# EAGLE design front (EAGLE 6.1)
DOC: PVR-SCH-001; PART_NO: PC-01; PROJECT: PVR; REV: B; TITLE: Front panel interface
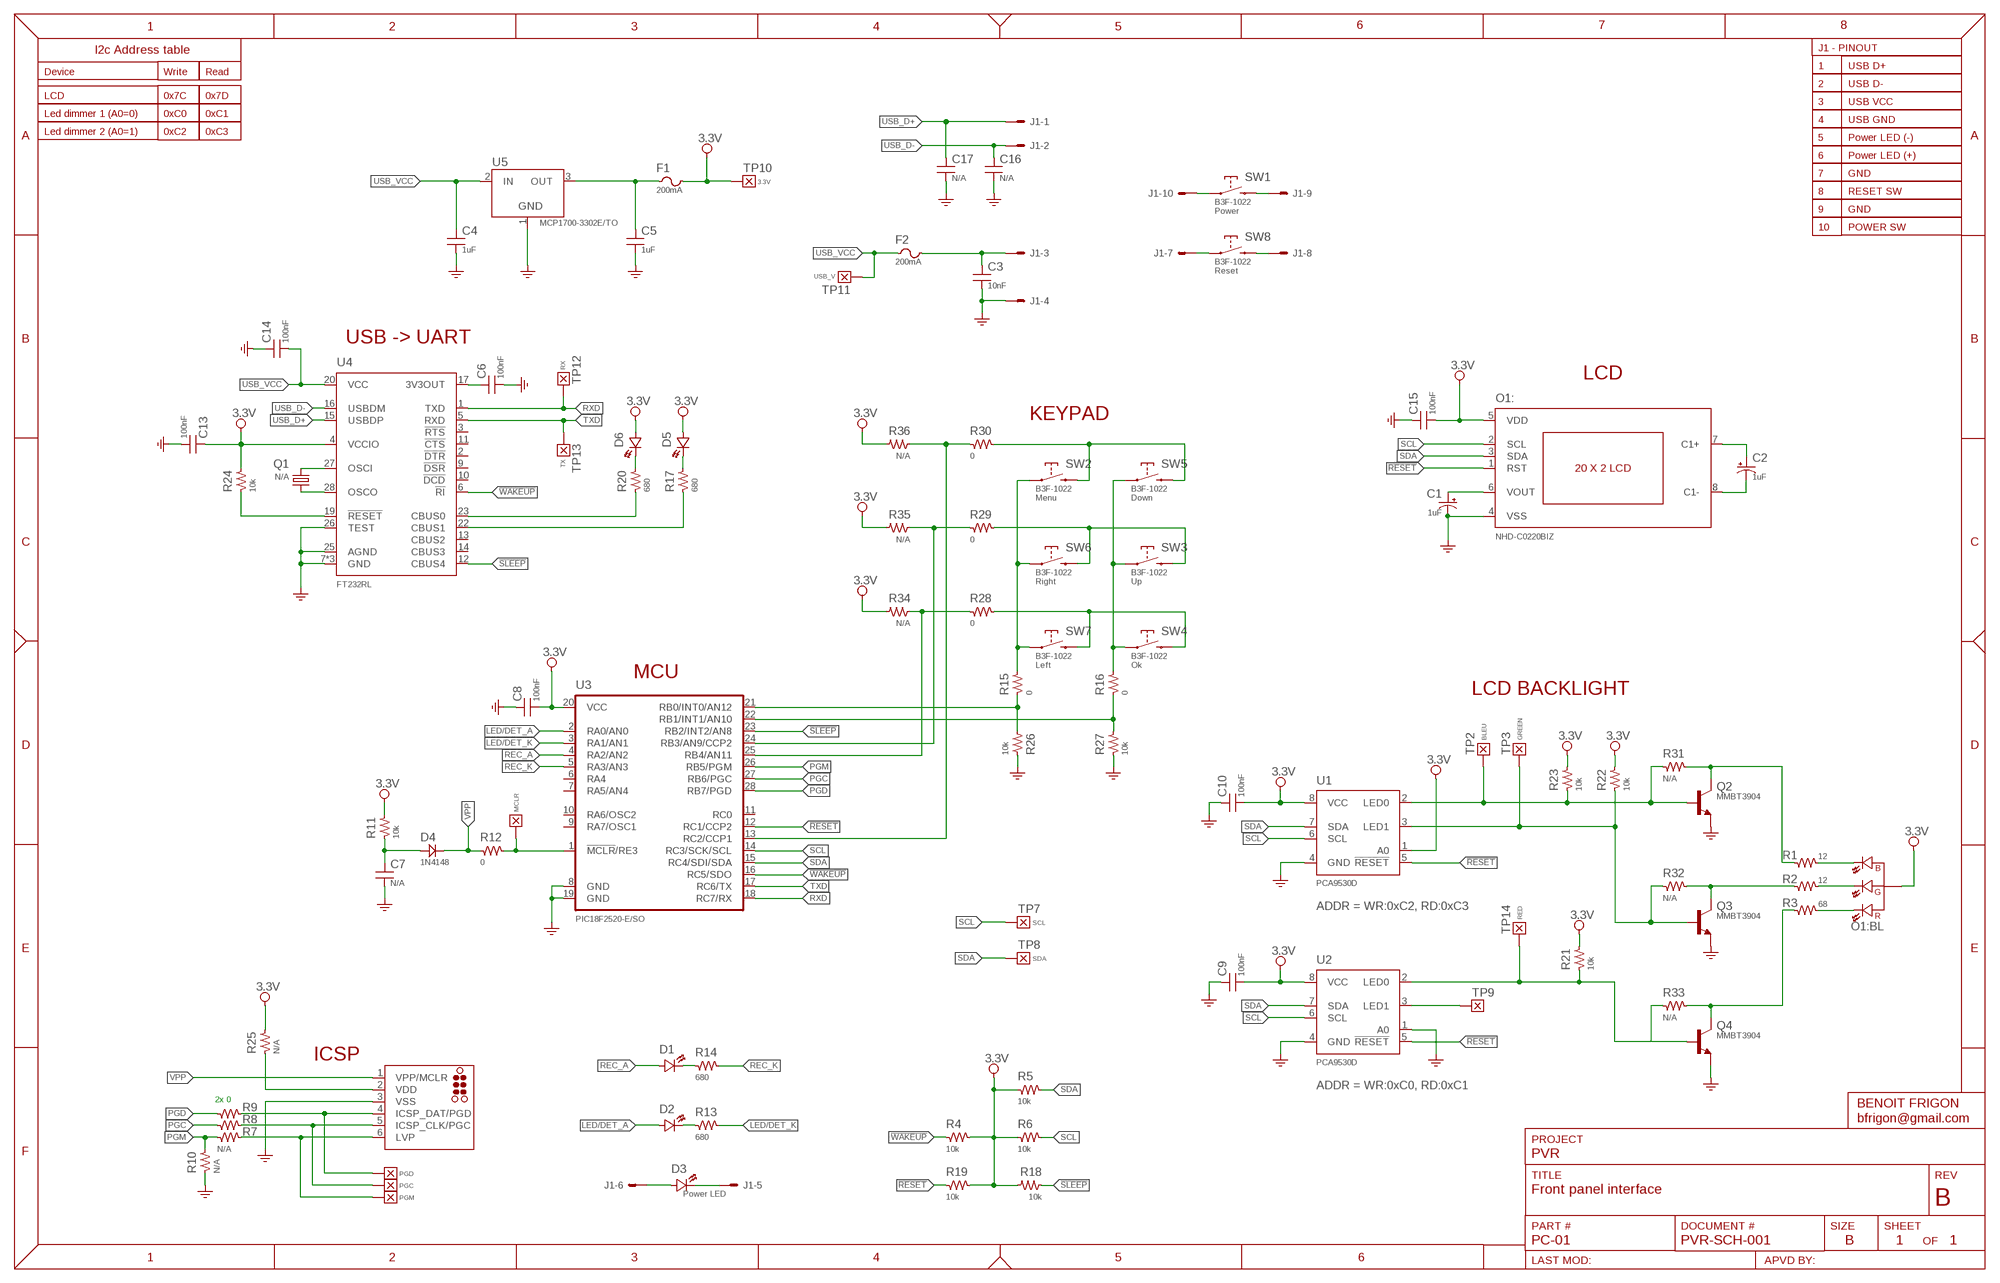
[diagram p0: schematic, sheet 1]

## Parts
C1  1uF  CAP-E-S0805  [CAP_S0805]
C2  1uF  CAP-E-S0805  [CAP_S0805]
C3  10nF  CAP-0805  [SMD_0805]
C4  1uF  CAP-0805  [SMD_0805]
C5  1uF  CAP-0805  [SMD_0805]
C6  100nF  CAP-0603  [SMD_0603]
C7  N/A  CAP-0603  [SMD_0603]
C8  100nF  CAP-0603  [SMD_0603]
C9  100nF  CAP-0603  [SMD_0603]
C10  100nF  CAP-0603  [SMD_0603]
C13  100nF  CAP-0603  [SMD_0603]
C14  100nF  CAP-0603  [SMD_0603]
C15  100nF  CAP-0603  [SMD_0603]
C16  N/A  CAP-0603  [SMD_0603]
C17  N/A  CAP-0603  [SMD_0603]
D1  {ATTR:COLOR}  LED-2X5  [LED_2X5]
D2  {ATTR:COLOR}  LED-2X5  [LED_2X5]
D3  {ATTR:COLOR}  LED-2X5  [LED_2X5]
D4  1N4148  DIODE-0603  [DIODE_0603]
D5  LED-0805  [CHIPLED_0805]
D6  LED-0805  [CHIPLED_0805]
F1  200mA  FUSE1206  [SMD_1206]
F2  200mA  FUSE1206  [SMD_1206]
J1  DL-100-HEADER-10-V  [534206-5]
J10  TC2030-MCP  [TC2030-MCP]
O1  NHD-C0220BIZ  [NHD-CO220BIZ]
Q1  N/A  XTALMM20SS  [MM20SS]
Q2  MMBT3904  [SOT23]
Q3  MMBT3904  [SOT23]
Q4  MMBT3904  [SOT23]
R1  12  RES-1206  [SMD_1206]
R2  12  RES-1206  [SMD_1206]
R3  68  RES-1206  [SMD_1206]
R4  10k  RES-0805  [SMD_0805]
R5  10k  RES-0805  [SMD_0805]
R6  10k  RES-0805  [SMD_0805]
R7  N/A  RES-0603  [SMD_0603]
R8  0  RES-0603  [SMD_0603]
R9  0  RES-0603  [SMD_0603]
R10  N/A  RES-0603  [SMD_0603]
R11  10k  RES-0603  [SMD_0603]
R12  0  RES-0603  [SMD_0603]
R13  680  RES-0805  [SMD_0805]
R14  680  RES-0805  [SMD_0805]
R15  0  RES-0805  [SMD_0805]
R16  0  RES-0805  [SMD_0805]
R17  680  RES-0805  [SMD_0805]
R18  10k  RES-0805  [SMD_0805]
R19  10k  RES-0805  [SMD_0805]
R20  680  RES-0805  [SMD_0805]
R21  10k  RES-0805  [SMD_0805]
R22  10k  RES-0805  [SMD_0805]
R23  10k  RES-0805  [SMD_0805]
R24  10k  RES-0603  [SMD_0603]
R25  N/A  RES-0603  [SMD_0603]
R26  10k  RES-0603  [SMD_0603]
R27  10k  RES-0603  [SMD_0603]
R28  0  RES-0603  [SMD_0603]
R29  0  RES-0805  [SMD_0805]
R30  0  RES-0805  [SMD_0805]
R31  N/A  RES-1206  [SMD_1206]
R32  N/A  RES-1206  [SMD_1206]
R33  N/A  RES-1206  [SMD_1206]
R34  N/A  RES-0603  [SMD_0603]
R35  N/A  RES-0603  [SMD_0603]
R36  N/A  RES-0603  [SMD_0603]
SW1  B3F-1022  [B3F-10XX]
SW2  B3F-1022  [B3F-10XX]
SW3  B3F-1022  [B3F-10XX]
SW4  B3F-1022  [B3F-10XX]
SW5  B3F-1022  [B3F-10XX]
SW6  B3F-1022  [B3F-10XX]
SW7  B3F-1022  [B3F-10XX]
SW8  B3F-1022  [B3F-10XX]
TP1  MCLR  TEST_POINT-050  [TP_050]
TP2  BLEU  TEST_POINT-050  [TP_050]
TP3  GREEN  TEST_POINT-050  [TP_050]
TP4  PGD  TEST_POINT-050  [TP_050]
TP5  PGC  TEST_POINT-050  [TP_050]
TP6  PGM  TEST_POINT-050  [TP_050]
TP7  SCL  TEST_POINT-050  [TP_050]
TP8  SDA  TEST_POINT-050  [TP_050]
TP9  TEST_POINT-050  [TP_050]
TP10  3.3V  TEST_POINT-050  [TP_050]
TP11  USB_V  TEST_POINT-050  [TP_050]
TP12  RX  TEST_POINT-050  [TP_050]
TP13  TX  TEST_POINT-050  [TP_050]
TP14  RED  TEST_POINT-050  [TP_050]
U1  PCA9530D  [SOIC8]
U2  PCA9530D  [SOIC8]
U3  PIC18F2520-E/SO  [SOIC28]
U4  FT232RL  [SSOP28]
U5  MCP1700-3302E/TO  [TO92]

## Nets
3.3V: C8.2 C9.2 C10.2 C13.1 C15.2 D5.A D6.A F1.2 O1.5(::VDD) O1.A(:BL:A) R4.2 R5.1 R6.1 R11.2 R18.2 R19.2 R21.2 R22.2 R23.2 R24.2 R25.2 R34.2 R35.2 R36.2 TP10.1 U1.1(A0) U1.8(VCC) U2.8(VCC) U3.20(VCC) U4.4(VCCIO)
!RESET: O1.1(::RST) R19.1 U1.5(!RESET) U2.5(!RESET) U3.12(RC1/CCP2)
!SLEEP: R18.1 U3.23(RB2/INT2/AN8) U4.12(CBUS4)
!WAKEUP: R4.1 U3.16(RC5/SDO) U4.6(!RI)
GND: C1.- C3.2 C4.2 C5.2 C6.2 C7.2 C8.1 C9.1 C10.1 C13.2 C14.1 C15.1 C16.2 C17.2 J1.4 J10.3(VSS) O1.4(::VSS) Q2.2(E) Q3.2(E) Q4.2(E) R10.1 R26.1 R27.1 U1.4(GND) U2.1(A0) U2.4(GND) U3.8(GND) U3.19(GND) U4.7(GND) U4.18(GND) U4.21(GND) U4.25(AGND) U4.26(TEST) U5.1(GND)
LED/DET_A: D2.A U3.2(RA0/AN0)
LED/DET_K: R13.2 U3.3(RA1/AN1)
N$4: O1.BK(:BL:BK) R1.2
N$5: O1.GK(:BL:GK) R2.2
N$6: O1.RK(:BL:RK) R3.2
N$7: Q2.1(B) R23.1 R31.1 TP2.1 U1.2(LED0)
N$8: Q3.1(B) R22.1 R32.1 TP3.1 U1.3(LED1)
N$9: Q2.3(C) R1.1 R31.2
N$10: J1.10 SW1.3 SW1.4
N$11: J1.9 SW1.1 SW1.2
N$12: J1.8 SW8.1 SW8.2
N$13: J1.7 SW8.3 SW8.4
N$14: D3.A J1.6
N$15: D3.K J1.5
N$17: C6.1 U4.17(3V3OUT)
N$18: J10.6(LVP) R7.2 TP6.1
N$19: J10.5(ICSP_CLK/PGC) R8.2 TP5.1
N$20: J10.4(ICSP_DAT/PGD) R9.2 TP4.1
N$21: R15.1 R26.2 U3.21(RB0/INT0/AN12)
N$22: R16.1 R27.2 U3.22(RB1/INT1/AN10)
N$23: R30.1 R36.1 U3.13(RC2/CCP1)
N$24: R29.1 R35.1 U3.24(RB3/AN9/CCP2)
N$25: R28.1 R34.1 U3.25(RB4/AN11)
N$26: R12.2 TP1.1 U3.1(!MCLR!/RE3)
N$27: D2.K R13.1
N$28: R15.2 SW2.3 SW2.4 SW6.3 SW6.4 SW7.3 SW7.4
N$29: D1.K R14.1
N$30: R16.2 SW3.3 SW3.4 SW4.3 SW4.4 SW5.3 SW5.4
N$31: R17.1 U4.22(CBUS1)
N$32: R20.1 U4.23(CBUS0)
N$33: D6.K R20.2
N$34: D5.K R17.2
N$35: Q3.3(C) R2.1 R32.2
N$36: Q4.3(C) R3.1 R33.2
N$37: C5.1 F1.1 U5.3(OUT)
N$38: Q4.1(B) R21.1 R33.1 TP14.1 U2.2(LED0)
N$39: C3.1 F2.2 J1.3
N$40: Q1.1 U4.27(OSCI)
N$41: Q1.4 U4.28(OSCO)
N$42: C2.+ O1.7(::C1+)
N$43: C2.- O1.8(::C1-)
N$44: C1.+ O1.6(::VOUT)
N$45: TP9.1 U2.3(LED1)
N$46: R24.1 U4.19(!RESET)
N$47: J10.2(VDD) R25.1
N$48: C7.1 D4.A R11.1
N$49: R30.2 SW2.1 SW2.2 SW5.1 SW5.2
N$50: R29.2 SW3.1 SW3.2 SW6.1 SW6.2
N$51: R28.2 SW4.1 SW4.2 SW7.1 SW7.2
PGC: R8.1 U3.27(RB6/PGC)
PGD: R9.1 U3.28(RB7/PGD)
PGM: R7.1 R10.2 U3.26(RB5/PGM)
REC_A: D1.A U3.4(RA2/AN2)
REC_K: R14.2 U3.5(RA3/AN3)
RXD: TP12.1 U3.18(RC7/RX) U4.1(TXD)
SCL: O1.2(::SCL) R6.2 TP7.1 U1.6(SCL) U2.6(SCL) U3.14(RC3/SCK/SCL)
SDA: O1.3(::SDA) R5.2 TP8.1 U1.7(SDA) U2.7(SDA) U3.15(RC4/SDI/SDA)
TXD: TP13.1 U3.17(RC6/TX) U4.5(RXD)
USB_D+: C17.1 J1.1 U4.15(USBDP)
USB_D-: C16.1 J1.2 U4.16(USBDM)
USB_VCC: C4.1 C14.2 F2.1 TP11.1 U4.20(VCC) U5.2(IN)
VPP: D4.K J10.1(VPP/MCLR) R12.1
Unconnected: U3.6(RA4) U3.7(RA5/AN4) U3.9(RA7/OSC1) U3.10(RA6/OSC2) U3.11(RC0) U4.2(!DTR) U4.3(!RTS) U4.9(!DSR) U4.10(!DCD) U4.11(!CTS) U4.13(CBUS2) U4.14(CBUS3)

## Notes on the sheet
- I2c Address table
- USB -> UART
- LCD
- KEYPAD
- MCU
- LCD BACKLIGHT
- ICSP
- 2x 0

## Library data of the parts
C1 C2 = Passive:CAP-E: Electrolytic capacitor; DESCRIPTION: {DESCRIPTION} - SMT 0805 - {VALUE}
C3-C5 = Passive:CAP: Capacitor; DESCRIPTION: {DESCRIPTION} - SMT 0805 - {value}; PACKAGE: SMT 0805
C6-C10 C13-C17 = Passive:CAP: Capacitor; DESCRIPTION: {DESCRIPTION} - SMT 0603 - {value}; PACKAGE: SMT 0603
D1 = Optoelectronic:LED: Led; COLOR: Red; DESCRIPTION: {DESCRIPTION} 2x5mm - {ATTR:COLOR}; PACKAGE: 2x5mm; SKU: -
D2 = Optoelectronic:LED: Led; COLOR: Green; DESCRIPTION: {DESCRIPTION} 2x5mm - {ATTR:COLOR}; PACKAGE: 2x5mm; SKU: -
D3 = Optoelectronic:LED: Led; COLOR: Green; DESCRIPTION: {DESCRIPTION} 2x5mm - {ATTR:COLOR}; ID: Power LED; PACKAGE: 2x5mm; SKU: -
D4 = Passive:DIODE: Diode; DESCRIPTION: {DESCRIPTION} - SMT 0603 - {VALUE}; PACKAGE: SMT 0603; SKU: {VALUE}
D5 D6 = Optoelectronic:LED: Led; COLOR: Green; DESCRIPTION: {DESCRIPTION} Chip 0805 - {ATTR:COLOR}; PACKAGE: SMT 0805; SKU: -; VALUE: {ATTR:COLOR}
F1 F2 = Passive:FUSE: Fuse; DESCRIPTION: {DESCRIPTION} - SMT 1206 - {VALUE}
J1 = Connectors:DL-100-HEADER-10: 10 Pos - Dual Row - 2.54mm; DESCRIPTION: {DESCRIPTION} Receptacle - Vertical; MFG: Sullins Connector Solutions; SKU: SIP110-PPPC-D05-ST-BK
J10 = Connectors:TC2030: TAG-CONNECT ISP Connector Manufacturer: Tag-Connect <www.tag-connect.com> Cable for easy In-Circuit PCB Programming. Designed for Microchip ICD2, suitable for many others. Two variants - one "with legs" (for hads-free fit on PCB) and another "without legs" for quick programming. PAD Description 1 MCLR/Vpp 2 Vdd 3 GND 4 PGD (ISPDAT) 5 PGC (ISPCLK) 6 nc (used for LVP) ©2009 ROFA.cz; MFG: Tag-Connect; NO_BOM: 1
O1 = Optoelectronic:NHD-C0220BIZ: Alphanumeric LCD module 20x2 - RGB Backlight; MFG: Newheaven Display
Q1 = Crystal:XTAL: Crystal
Q2-Q4 = Transistor:MMBT3904: NPN Transistor
R1-R3 R31-R33 = Passive:RES: Resistor; DESCRIPTION: {DESCRIPTION} - SMT 1206 - {VALUE}; PACKAGE: SMT 1206
R4-R6 R13-R23 R29 R30 = Passive:RES: Resistor; DESCRIPTION: {DESCRIPTION} - SMT 0805 - {VALUE}; PACKAGE: SMT 0805
R7-R12 R24-R28 R34-R36 = Passive:RES: Resistor; DESCRIPTION: {DESCRIPTION} - SMT 0603 - {VALUE}; PACKAGE: SMT 0603
SW1 = Switch:B3F-?: Tactile switch; DESCRIPTION: {DESCRIPTION} - 6x6mm - 5mm Pitch - 150g; KEY: Power; MFG: Omron Electronics
SW2 = Switch:B3F-?: Tactile switch; DESCRIPTION: {DESCRIPTION} - 6x6mm - 5mm Pitch - 150g; KEY: Menu; MFG: Omron Electronics
SW3 = Switch:B3F-?: Tactile switch; DESCRIPTION: {DESCRIPTION} - 6x6mm - 5mm Pitch - 150g; KEY: Up; MFG: Omron Electronics
SW4 = Switch:B3F-?: Tactile switch; DESCRIPTION: {DESCRIPTION} - 6x6mm - 5mm Pitch - 150g; KEY: Ok; MFG: Omron Electronics
SW5 = Switch:B3F-?: Tactile switch; DESCRIPTION: {DESCRIPTION} - 6x6mm - 5mm Pitch - 150g; KEY: Down; MFG: Omron Electronics
SW6 = Switch:B3F-?: Tactile switch; DESCRIPTION: {DESCRIPTION} - 6x6mm - 5mm Pitch - 150g; KEY: Right; MFG: Omron Electronics
SW7 = Switch:B3F-?: Tactile switch; DESCRIPTION: {DESCRIPTION} - 6x6mm - 5mm Pitch - 150g; KEY: Left; MFG: Omron Electronics
SW8 = Switch:B3F-?: Tactile switch; DESCRIPTION: {DESCRIPTION} - 6x6mm - 5mm Pitch - 150g; KEY: Reset; MFG: Omron Electronics
TP1-TP14 = Misc:TEST_POINT; NO_BOM: 1
U1 = IC:PCA9530: 8-bit I2C-bus LED dimmer Features: 2 LED drivers (on, off, flashing at a programmable rate) 2 selectable, fully programmable blink rates (frequency and duty cycle) between 0.591 Hz and 152 Hz (1.69 seconds and 6.58 milliseconds) 256 brightness steps Input/output not used as LED drivers can be used as regular GPIOs Internal oscillator requires no external components I2C-bus interface logic compatible with SMBus Internal power-on reset; ADDR: WR:0xC2, RD:0xC3; MFG: NXP Semiconductors
U2 = IC:PCA9530: 8-bit I2C-bus LED dimmer Features: 2 LED drivers (on, off, flashing at a programmable rate) 2 selectable, fully programmable blink rates (frequency and duty cycle) between 0.591 Hz and 152 Hz (1.69 seconds and 6.58 milliseconds) 256 brightness steps Input/output not used as LED drivers can be used as regular GPIOs Internal oscillator requires no external components I2C-bus interface logic compatible with SMBus Internal power-on reset; ADDR: WR:0xC0, RD:0xC1; MFG: NXP Semiconductors
U3 = IC:PIC18F*520-?: Microcontroller 32k PROG / 1536 RAM / 256 EEPROM
U4 = IC:FT232: USB to serial UART interface
U5 = Power:MCP1700-*?: Low-dropout (LDO) Voltage Regulator; DESCRIPTION: {DESCRIPTION} - 3.3v; MFG: Microchip

## Board
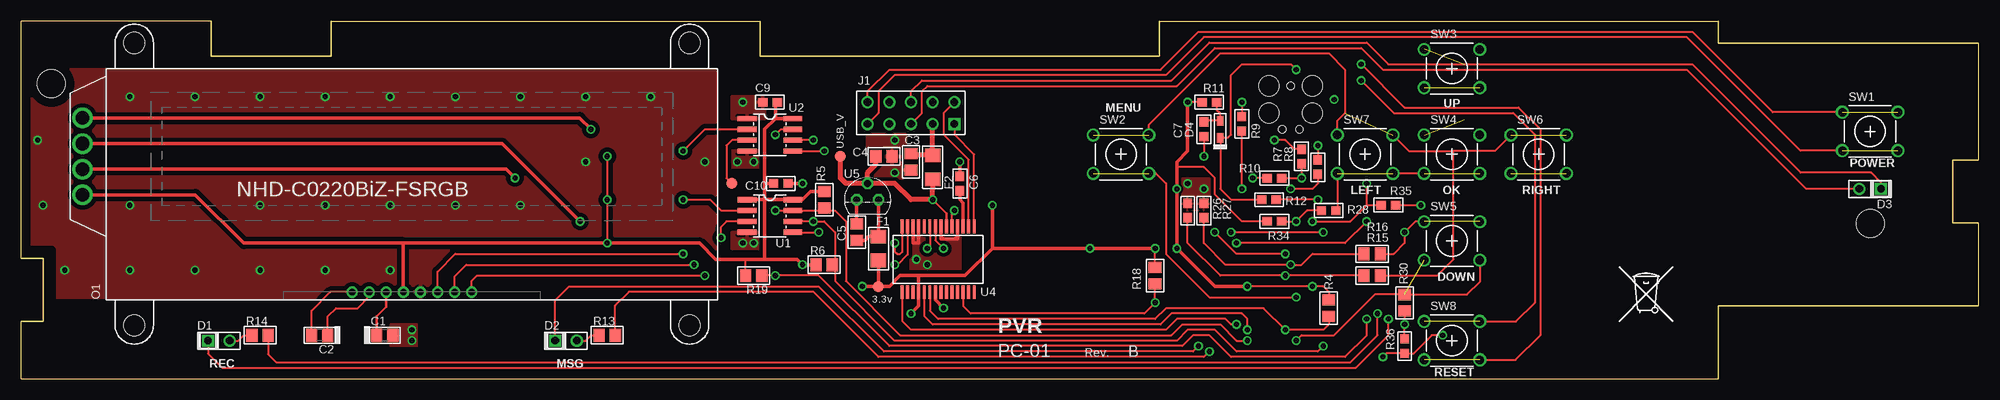
[diagram p1: board, top side]
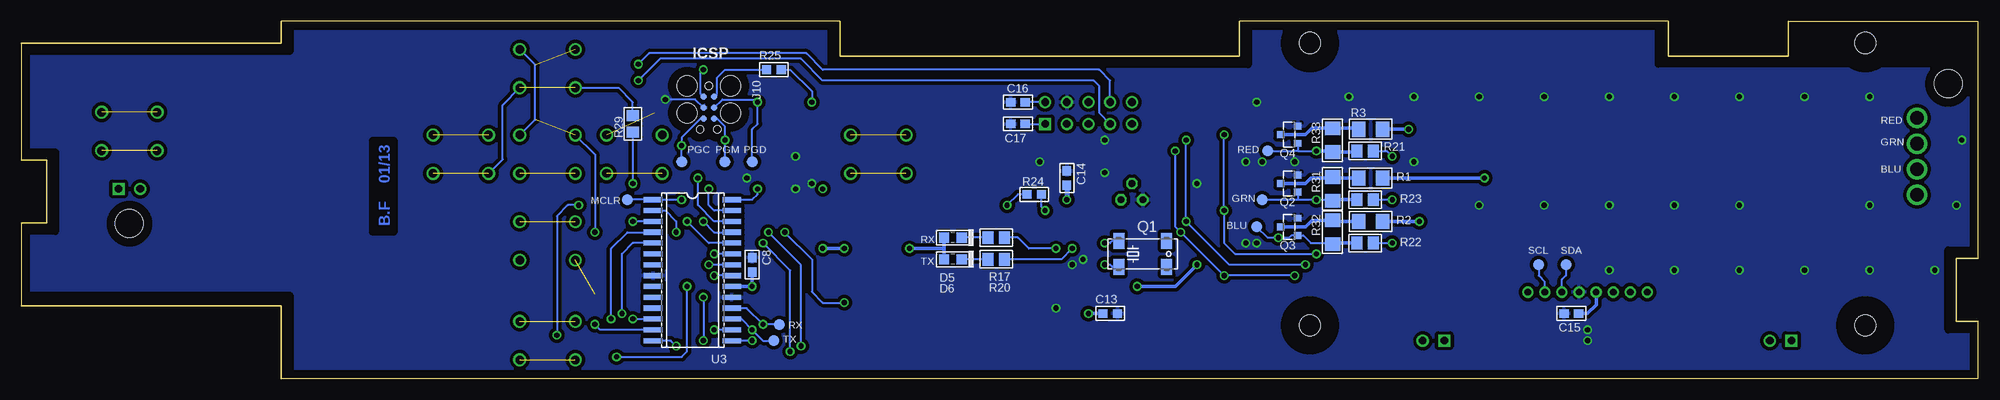
[diagram p2: board, bottom side, seen from below]

Size 229.06 x 41.86 mm. Coordinates in mm from the lower left corner, seen from the top.
Outline: 0,0 198.63,0 198.63,8.51 229.06,8.51 229.06,18.24 226.06,18.24 226.06,25.58 229.06,25.58 229.06,39.32 198.63,39.32 198.63,41.86 133.25,41.86 133.25,37.8 86.46,37.8 86.46,41.86 36.27,41.86 36.27,37.8 22.23,37.8 22.23,41.86 0,41.86 0,14.07 2.54,14.07 2.54,6.71 0,6.71 0,0
Copper layers (1*16): Top 0.035mm / dielectric 1.5mm / Bottom 0.035mm
Design rules: minimum track width 10mil, minimum drill 24mil, track to track 8mil, track to pad 8mil, pad to pad 8mil, via to via 8mil, smd to smd 8mil, copper to edge 40mil, drill to drill 8mil, minimum pad ring 10mil, minimum via ring 8mil, stop-mask expansion 4mil, vias tented up to drill 24mil, thermal gap 10mil
Holes 3.3 mm at 3.51,34.54 216.41,18.16
tKeepout: area 178.6,31.1 to 182.1,34.6; area 178.6,17.9 to 182.1,21.5; area 191.4,16.8 to 195,20.3; area 219.3,16.8 to 222.9,20.3; area 150.6,17.9 to 154.2,21.5; area 141.2,24.3 to 144.8,27.8; area 134.6,5.1 to 151.1,7.6; area 134.6,35.6 to 151.1,38.1
tRestrict: area 0,5.7 to 3.6,15.1
bRestrict: area 185.4,17.1 to 188,27.9; area 0,36.8 to 37.5,41.9; area 85.4,36.8 to 134.3,41.9; area 0,5.7 to 3.6,15.1; area 197.6,0 to 229.1,9.8; area 225,17.2 to 229.1,26.6; area 197.6,38.3 to 229.1,41.9
Milling: 16 lines

### Footprints (pad centres in the part's own frame; a part is rotated, then mirrored left to right if it is on the bottom)
CAP_S0805 = smd 1.3 x 1.5: + -0.95,0; - 0.95,0
SMD_0805 = smd 1.3 x 1.5: 1 -0.95,0; 2 0.95,0
SMD_0603 = smd 1.1 x 1: 1 -0.85,0; 2 0.85,0
LED_2X5 = drill 0.9 square: A -1.27,0 | drill 0.9: K 1.27,0
DIODE_0603 = smd 1.1 x 0.8: A -1,0; K 1,0
CHIPLED_0805 = smd 1.2 x 1.2: A 0,-1.05; K 0,1.05
SMD_1206 = smd 1.6 x 1.8: 1 -1.4,0; 2 1.4,0
534206-5 = drill 0.9 square: 1 5.08,-1.27 | drill 0.9: 2 5.08,1.27; 3 2.54,-1.27; 4 2.54,1.27; 5 0,-1.27; 6 0,1.27; 7 -2.54,-1.27; 8 -2.54,1.27; 9 -5.08,-1.27; 10 -5.08,1.27
TC2030-MCP = smd 0.787 x 0.787: 1 1.27,-0.635; 2 1.27,0.635; 3 2.54,-0.635; 4 2.54,0.635; 5 3.81,-0.635; 6 3.81,0.635 | hole 0.889: 0,0; 5.08,-1.016; 5.08,1.016 | hole 2.375: 0,2.54; 0,-2.54; 3.175,-2.54; 3.175,2.54
NHD-CO220BIZ = drill 0.8: 1 7,-15.9; 2 5,-15.9; 3 3,-15.9; 4 1,-15.9; 5 -1,-15.9; 6 -3,-15.9; 7 -5,-15.9; 8 -7,-15.9 | drill 1.6: A -38.55,-4.5; BK -38.55,-1.5; GK -38.55,1.5; RK -38.55,4.5 | hole 2.5: -32.5,13.3; 32.5,13.3; 32.5,-19.8; -32.5,-19.8
MM20SS = smd 1.27 x 1.88: 1 -2.794,-1.524; 2 2.794,-1.524; 3 2.794,1.524; 4 -2.794,1.524
SOT23 = smd 0.8 x 0.9: 1 -1,-1; 2 1,-1; 3 0,1
B3F-10XX = drill 1: 1 3.25,-2.25; 2 -3.25,-2.25; 3 3.25,2.25; 4 -3.25,2.25
TP_050 = smd 1.27 x 1.27: 1 0,0
SOIC8 = smd 0.6 x 2.2: 1 -1.905,-2.667; 2 -0.635,-2.667; 3 0.635,-2.667; 4 1.905,-2.667; 5 1.905,2.667; 6 0.635,2.667; 7 -0.635,2.667; 8 -1.905,2.667
SOIC28 = smd 0.6 x 2.2: 1 -8.255,-4.6; 2 -6.985,-4.6; 3 -5.715,-4.6; 4 -4.445,-4.6; 5 -3.175,-4.6; 6 -1.905,-4.6; 7 -0.635,-4.6; 8 0.635,-4.6; 9 1.905,-4.6; 10 3.175,-4.6; 11 4.445,-4.6; 12 5.715,-4.6; 13 6.985,-4.6; 14 8.255,-4.6; 15 8.255,4.6; 16 6.985,4.6; 17 5.715,4.6; 18 4.445,4.6; 19 3.175,4.6; 20 1.905,4.6; 21 0.635,4.6; 22 -0.635,4.6; 23 -1.905,4.6; 24 -3.175,4.6; 25 -4.445,4.6; 26 -5.715,4.6; 27 -6.985,4.6; 28 -8.255,4.6
SSOP28 = smd 0.34 x 1.6: 1 -4.225,-3.85; 2 -3.575,-3.85; 3 -2.925,-3.85; 4 -2.275,-3.85; 5 -1.625,-3.85; 6 -0.975,-3.85; 7 -0.325,-3.85; 8 0.325,-3.85; 9 0.975,-3.85; 10 1.625,-3.85; 11 2.275,-3.85; 12 2.925,-3.85; 13 3.575,-3.85; 14 4.225,-3.85; 15 4.225,3.85; 16 3.575,3.85; 17 2.925,3.85; 18 2.275,3.85; 19 1.625,3.85; 20 0.975,3.85; 21 0.325,3.85; 22 -0.325,3.85; 23 -0.975,3.85; 24 -1.625,3.85; 25 -2.275,3.85; 26 -2.925,3.85; 27 -3.575,3.85; 28 -4.225,3.85
TO92 = drill 0.813 octagon: 1 -1.27,0; 2 0,1.905; 3 1.27,0

### Placement (x,y rotation side)
C1  42.55,5.08 0 top
C2  34.92,5.08 180 top
C3  104.14,25.4 270 top
C4  100.97,26.04 0 top
C5  97.79,17.14 90 top
C6  109.86,22.86 90 top
C7  138.43,29.21 270 top
C8  143.51,13.34 270 bottom
C9  87.63,32.38 0 top
C10  88.9,22.86 180 top
C13  101.6,7.62 0 bottom
C14  106.68,23.5 270 bottom
C15  47.62,7.62 0 bottom
C16  112.39,32.38 180 bottom
C17  112.39,29.84 180 bottom
D1  23.11,4.45 0 top
D2  63.75,4.45 0 top
D3  216.41,22.23 180 top
D4  140.34,29.21 270 top
D5  120.02,16.51 270 bottom
D6  120.02,13.97 270 bottom
F1  100.33,15.24 270 top
F2  106.68,24.77 90 top
J1  104.14,31.11 0 top
J10  148.59,34.29 270 bottom
O1  45.72,26.04 0 top
Q1  97.79,14.61 0 bottom
Q2  80.64,22.86 90 bottom
Q3  80.64,17.78 90 bottom
Q4  80.64,28.57 90 bottom
R1  71.12,23.5 0 bottom
R2  71.12,18.41 0 bottom
R3  71.12,29.21 0 bottom
R4  153.03,8.26 90 top
R5  93.98,20.95 270 top
R6  93.98,13.34 0 top
R7  149.86,26.04 90 top
R8  151.76,24.77 90 top
R9  142.88,29.84 90 top
R10  146.69,23.5 0 top
R11  139.06,32.38 180 top
R12  146.05,20.95 0 top
R13  68.58,5.08 0 top
R14  27.94,5.08 0 top
R15  158.12,12.06 0 top
R16  158.12,14.61 0 top
R17  114.94,16.51 180 bottom
R18  132.72,12.06 90 top
R19  85.72,12.06 180 top
R20  114.94,13.97 180 bottom
R21  71.75,26.67 0 bottom
R22  71.75,15.88 0 bottom
R23  71.75,20.95 0 bottom
R24  110.49,21.59 180 bottom
R25  140.97,36.2 0 bottom
R26  136.53,19.68 270 top
R27  138.43,19.68 270 top
R28  153.03,19.68 0 top
R29  157.48,29.84 90 bottom
R30  161.93,8.89 90 top
R31  75.56,22.23 90 bottom
R32  75.56,17.14 90 bottom
R33  75.56,27.94 90 bottom
R34  146.69,18.41 180 top
R35  160.02,20.32 0 top
R36  161.93,3.81 270 top
SW1  216.41,28.96 0 top
SW2  128.73,26.29 0 top
SW3  167.46,36.32 0 top
SW4  167.46,26.29 0 top
SW5  167.46,16.13 0 top
SW6  177.62,26.29 0 top
SW7  157.3,26.29 0 top
SW8  167.46,4.45 0 top
TP1  158.12,20.95 0 bottom
TP2  83.82,20.95 0 bottom
TP3  84.45,17.78 0 bottom
TP4  143.51,25.4 0 bottom
TP5  151.76,25.4 0 bottom
TP6  146.69,25.4 0 bottom
TP7  51.44,13.34 0 bottom
TP8  48.26,13.34 0 bottom
TP9  83.19,22.86 0 top
TP10  100.33,10.79 0 top
TP11  95.89,26.04 0 top
TP12  140.34,6.35 0 bottom
TP13  140.97,4.45 90 bottom
TP14  83.19,26.67 0 bottom
U1  87.63,19.05 270 top
U2  87.63,28.57 270 top
U3  150.5,12.7 270 bottom
U4  107.31,13.97 0 top
U5  99.06,20.95 0 top
U$1  [INFO]  125.73,5.08 0 top
U$2  [TRASH_SMALL]  190.5,10.16 0 top
U$3  [INFO_AUTHOR]  186.69,19.68 270 bottom
U$4  [INFO_DATE]  186.69,25.4 270 bottom

### Tracks (layer width: path | path; a pad name or v marks a point on that pad's centre or on a via)
3.3V  (via drill 0.61)
  Top 0.254: R19.2 84.78,13.97 | v143.51,10.79 v151.13,10.79 152.4,10.79 153.03,10.16 R4.2 | v68.58,15.88 v68.58,20.95 v68.58,26.04 | R11.2 v136.53,32.38 | R18.2 v132.72,15.24 | R34.2 142.88,18.41 139.7,21.59 139.7,23.5 138.43,24.77 135.25,24.77 | v159.38,2.54 159.81,2.96 R36.2 162.98,2.96 165.1,5.08 v166.37,5.08 | R35.2 v163.83,20.32
  Top 0.406: 44.72,15.88 v68.58,15.88 79.38,15.88 81.28,13.97 84.78,13.97 87,13.97 | 87,20.95 U1.8 91.44,20.95 92.39,21.91 R5.1 | 87,13.97 87,20.95 | U1.1 87,20.95 | 105.04,12.06 102.87,12.06 101.6,10.79 TP10.1 | U2.8 88.27,30.48 | C9.2 88.27,32.38 88.27,30.48 | 88.27,30.48 87,29.21 87,22.86 | 87,22.86 87,20.95 | C10.2 87,22.86 | v136.53,32.38 136.53,26.67 135.25,25.4 135.25,24.77 v135.25,22.23 v135.25,15.24 139.7,10.79 v143.51,10.79 | 87,13.97 90.81,13.97 v91.44,13.34 R6.1 | v98.42,10.79 TP10.1 | F1.2 TP10.1 | v132.72,15.24 v125.09,15.24 113.67,15.24 | v104.14,7.62 105.04,8.52 U4.4 105.04,12.06 | O1.5 44.72,15.88 | 113.67,15.24 110.49,12.06 105.04,12.06 | 113.67,15.24 v113.67,20.32 | 44.72,15.88 26.04,15.88 20.38,21.54 O1.A
  Bottom 0.254: R22.2 v68.58,15.88 | R23.2 v68.58,20.95 | R21.2 69.22,26.67 v68.58,26.04 | R24.2 112.39,21.59 v113.67,20.32 | R25.2 139.06,36.2 136.53,33.66 v136.53,32.38 | v159.38,2.54 151.76,2.54 151.13,3.17 v151.13,10.79 | v163.83,20.32 165.1,20.32 166.37,19.05 v166.37,5.08
  Bottom 0.406: v91.44,13.34 93.98,10.79 v98.42,10.79 | U3.20 v143.51,10.79 C8.2 | v132.72,15.24 v135.25,15.24 | C13.1 v104.14,7.62 | C15.2 45.72,7.62 44.72,8.62 O1.5 | D5.A 121.06,15.24 | 121.06,15.24 v125.09,15.24 | D6.A 121.06,15.24
!RESET  (via drill 0.61)
  Top 0.254: O1.1 52.72,11.45 53.34,12.06 v80.01,12.06 | U2.5 v93.98,26.67 | U1.5 v93.34,17.14 | R19.1 v88.27,12.06 93.34,12.06 101.6,3.81 135.89,3.81 137.16,5.08 139.06,5.08 141.6,2.54 154.94,2.54 157.48,5.08 v157.48,6.99
  Bottom 0.254: v80.01,12.06 v88.27,12.06 v93.34,17.14 93.98,17.78 v93.98,26.67 | v157.48,6.99 U3.12
!SLEEP  (via drill 0.61)
  Top 0.254: v147.96,14.61 142.24,14.61 v139.7,17.14 | U4.12 110.24,8.51 111.12,7.62 131.44,7.62 v132.72,8.89 R18.1
  Bottom 0.254: U3.23 v147.96,14.61 | v139.7,17.14 136.53,13.97 136.53,10.16 135.25,8.89 v132.72,8.89
!WAKEUP  (via drill 0.61)
  Top 0.254: R4.1 153.03,6.35 152.4,5.71 v147.96,5.71 145.41,8.26 133.99,8.26 132.72,6.99 107.31,6.99 106.34,7.96 U4.6
  Bottom 0.254: U3.16 v147.96,5.71
GND  (via drill 0.61)
  Top 0.254: C7.2 v138.43,26.04 | R10.1 v144.15,23.5
  Top 0.406: C6.2 v109.86,25.4 | C10.1 v91.44,22.86 | C5.2 U5.1 | U4.7 106.99,9.21 v107.95,8.26 | U4.26 104.39,15.88 105.04,15.88 U4.25 | U4.21 107.64,16.38 109.59,16.38 U4.18
  Bottom 0.254: J10.3 150.18,32.7 v153.67,32.7
  other vias: 102.23,27.94 102.23,24.13 104.78,13.97 106.05,13.34 83.82,25.4 84.45,15.88 84.45,32.38 85.72,15.88 85.72,25.4 45.72,4.45 45.72,5.71 5.08,12.7 1.91,27.94 2.54,20.32 12.7,33.02 12.7,12.7 12.7,20.32 20.32,12.7 58.42,20.32 43.18,12.7 27.94,12.7 27.94,20.32 35.56,12.7 35.56,33.02 27.94,33.02 20.32,33.02 35.56,20.32 43.18,20.32 50.8,20.32 43.18,33.02 50.8,33.02 58.42,33.02 66.04,33.02 73.66,33.02 66.04,25.4 80.01,25.4 138.43,22.23 136.53,22.86
  pour Bottom (isolate 0.406): 0,0 0,41.86 229.06,41.86 229.06,0
  pour Top (isolate 0.406): 103.5,23.5 103.5,28.57 99.06,28.57 99.06,23.5
  pour Top: 87,30.48 83.19,30.48 83.19,33.02 87,33.02
  pour Top (isolate 0.406): 86.36,15.24 83.19,15.24 83.19,17.14 86.36,17.14
  pour Top (isolate 0.406): 87,24.77 83.19,24.77 83.19,26.67 87,26.67
  pour Top: 43.18,3.81 46.35,3.81 46.35,6.35 43.18,6.35
  pour Top (isolate 0.406): 104.14,16.51 104.14,12.7 109.86,12.7 109.86,16.51
  pour Top (isolate 0.508): 1.27,9.53 1.27,36.2 81.28,36.2 81.28,9.53
  pour Top: 139.06,19.68 135.89,19.68 135.89,23.5 139.06,23.5
LED/DET_A  (via drill 0.61)
  Top 0.254: v137.79,3.81 137.16,3.17 100.97,3.17 93.34,10.79 64.14,10.79 62.48,9.14 D2.A | v152.4,17.14 v141.6,17.14
  Bottom 0.254: v141.6,17.14 137.79,13.34 v137.79,3.81 | U3.2 153.67,19.68 152.4,18.41 v152.4,17.14
LED/DET_K  (via drill 0.61)
  Top 0.254: v139.06,3.17 138.43,2.54 100.33,2.54 92.71,10.16 71.12,10.16 69.53,8.57 R13.2 | v157.48,18.41 154.94,15.88 v142.24,15.88
  Bottom 0.254: v142.24,15.88 139.06,12.7 v139.06,3.17 | U3.3 v157.48,18.41
N$4  (via drill 0.61)
  Top 0.406: O1.BK 56.74,24.54 v57.78,23.5
  Bottom 0.406: v57.78,23.5 R1.2
N$5  (via drill 0.61)
  Top 0.406: v65.41,18.41 56.28,27.54 O1.GK
  Bottom 0.406: R2.2 v65.41,18.41
N$6  (via drill 0.61)
  Top 0.406: O1.RK 65.35,30.54 v66.67,29.21
  Bottom 0.406: v66.67,29.21 R3.2
N$7  (via drill 0.61)
  Top 0.254: v77.47,20.95 80.64,20.95 81.92,19.68 U1.2
  Bottom 0.254: Q2.1 79.64,20.95 | 75.56,20.95 v77.47,20.95 79.38,20.95 79.64,20.95 | TP2.1 79.64,20.95
  Bottom 0.406: R23.1 75.56,20.95 R31.1
N$8  (via drill 0.61)
  Top 0.254: v81.92,16.51 81.92,17.78 82.55,18.41 U1.3
  Bottom 0.254: 75.56,15.88 78.11,15.88 79.01,16.78 Q3.1 80.38,16.78 80.64,16.51 v81.92,16.51 83.19,16.51 TP3.1
  Bottom 0.406: R22.1 75.56,15.88 R32.1
N$9
  Bottom 0.406: R1.1 75.56,23.5 | 75.56,23.5 R31.2 | Q2.3 78.74,22.86 78.11,23.5 75.56,23.5
N$10  (1 unrouted)
  Top 0.254: J1.10 99.06,33.66 101.6,36.2 133.35,36.2 137.79,40.64 195.58,40.64 205.01,31.21 SW1.4
N$11  (1 unrouted)
  Top 0.254: J1.9 100.33,31.11 100.33,33.66 102.23,35.56 133.99,35.56 138.43,40.01 194.94,40.01 207.65,27.3 207.99,26.96 208.24,26.71 SW1.2
N$12  (via drill 0.61)  (1 unrouted)
  Top 0.254: v156.84,36.83 161.93,31.75 175.26,31.75 177.8,29.21 177.8,5.08 174.91,2.19 SW8.1
  Bottom 0.254: J1.8 101.6,34.92 102.87,36.2 135.25,36.2 137.16,38.1 155.57,38.1 v156.84,36.83
N$13  (via drill 0.61)  (1 unrouted)
  Top 0.254: v156.84,34.92 160.66,31.11 174.62,31.11 177.16,28.57 177.16,8.89 174.97,6.7 SW8.3
  Bottom 0.254: J1.7 102.87,31.11 102.87,34.29 103.5,34.92 135.25,34.92 137.79,37.47 154.31,37.47 v156.84,34.92
N$14
  Top 0.254: J1.6 104.14,33.66 105.41,34.92 134.62,34.92 139.06,39.37 157.48,39.37 160.02,36.83 195.58,36.83 208.28,24.13 216.53,24.13 217.68,22.99 D3.A
N$15
  Top 0.254: J1.5 105.41,31.11 105.41,33.66 106.05,34.29 135.25,34.29 139.7,38.73 156.84,38.73 159.38,36.2 194.94,36.2 208.91,22.23 D3.K
N$17
  Top 0.406: C6.1 109.86,20.95 110.24,20.57 U4.17
N$18  (via drill 0.61)
  Top 0.254: R7.2 149.01,26.89 147.96,27.94 v146.69,27.94
  Bottom 0.254: J10.6 147.64,30.48 146.69,29.53 v146.69,27.94 TP6.1
N$19  (via drill 0.61)
  Top 0.254: v151.76,27.3 R8.2
  Bottom 0.254: J10.5 149.54,30.48 151.76,28.26 v151.76,27.3 TP5.1
N$20  (via drill 0.61)
  Top 0.254: v142.88,32.38 R9.2
  Bottom 0.254: J10.4 147,32.7 143.19,32.7 v142.88,32.38 142.88,29.84 143.51,29.21 TP4.1
N$21  (via drill 0.61)
  Top 0.254: R15.1 v147.96,12.06 140.34,12.06 136.53,15.88 R26.2
  Bottom 0.254: U3.21 v147.96,12.06
N$22  (via drill 0.61)
  Top 0.254: R16.1 151.13,14.61 149.86,13.34 v148.59,13.34 140.97,13.34 138.43,15.88 R27.2
  Bottom 0.254: U3.22 v148.59,13.34
N$23  (via drill 0.61)
  Top 0.254: R30.1 v161.93,6.35 R36.1
  Bottom 0.254: U3.13 161.29,5.71 v161.93,6.35
N$24  (via drill 0.61)
  Top 0.254: v151.13,18.41 155.57,18.41 157.48,20.32 | 157.48,20.32 v157.48,22.86 | 157.48,20.32 R35.1
  Bottom 0.254: U3.24 148.59,15.88 v151.13,18.41 | R29.1 v157.48,22.86
N$25  (via drill 0.61)
  Top 0.254: R28.1 150.5,19.68 v149.22,18.41 R34.1
  Bottom 0.254: v149.22,18.41 147.96,17.14 U3.25
N$26  (via drill 0.61)
  Top 0.254: v151.76,20.95 R12.2
  Bottom 0.254: v151.76,20.95 U3.1 TP1.1
N$27
  Top 0.254: D2.K 66.04,4.45 66.67,5.08 R13.1
N$28  (3 unrouted)
  Top 0.254: SW2.3 131.98,29.74 140.34,38.1 153.03,38.1 154.94,36.2 154.94,31.11 154.05,30.23 SW7.4 | 167.64,26.67 167.64,13.97 165.74,12.06 R15.2 | SW6.4 172.5,26.67 167.64,26.67 | SW7.3 162.42,26.67 167.64,26.67
N$29
  Top 0.254: D1.K 25.4,4.45 26.04,5.08 R14.1
N$30  (via drill 0.61)  (3 unrouted)
  Top 0.254: R16.2 160.66,14.61 161.93,15.88 v161.93,17.14 163.16,18.38 SW5.4
  Bottom 0.254: SW3.3 168.91,36.77 168.91,30.34 SW4.3 | SW4.4 161.93,26.25 v161.93,17.14
N$31  (via drill 0.61)
  Top 0.254: U4.22 106.99,16.2 v107.95,15.24
  Bottom 0.254: v107.95,15.24 111.12,15.24 112.39,16.51 R17.1
N$32  (via drill 0.61)
  Top 0.254: U4.23 106.34,15.54 v106.05,15.24
  Bottom 0.254: v106.05,15.24 107.31,13.97 R20.1
N$33
  Bottom 0.254: R20.2 D6.K
N$34
  Bottom 0.254: R17.2 D5.K
N$35
  Bottom 0.406: R2.1 75.56,18.41 R32.2 77.97,18.55 78.74,17.78 Q3.3
N$36
  Bottom 0.254: 72.65,29.34 R3.1
  Bottom 0.406: Q4.3 78.74,28.57 77.97,29.34 R33.2 72.65,29.34
N$37
  Top 0.406: U5.3 F1.1 99.19,16.64 98.75,16.2 C5.1
N$38  (via drill 0.61)
  Top 0.254: v77.47,26.67 80.01,29.21 U2.2
  Bottom 0.254: Q4.1 79.64,26.67 | TP14.1 80.01,26.67 79.64,26.67 | 79.64,26.67 v77.47,26.67
  Bottom 0.406: R21.1 72.7,26.54 R33.1 75.56,26.67 v77.47,26.67
N$39
  Top 0.61: 106.68,26.04 F2.2 | F2.2 J1.3 | F2.2 104.14,26.16 C3.1
N$40  (via drill 0.61)
  Top 0.254: U4.27 103.74,14.52 102.55,13.34 v102.23,13.34
  Bottom 0.254: Q1.1 101.35,13.08 101.6,13.34 v102.23,13.34
N$41  (via drill 0.61)
  Top 0.254: U4.28 103.09,14.82 102.87,14.61 102.55,14.61 102.23,14.92 v102.23,15.88
  Bottom 0.254: Q1.4 101.35,16.13 101.6,15.88 v102.23,15.88
N$42
  Top 0.254: C2.+ 35.88,7.3 36.83,8.26 39.37,8.26 40.72,9.61 O1.7
N$43
  Top 0.254: O1.8 36.17,10.13 33.98,7.94 C2.-
N$44
  Top 0.305: O1.6 42.72,8.43 41.59,7.3 C1.+
N$45
  Top 0.254: U2.3 83.19,27.94 82.55,27.3 82.55,23.5 TP9.1
N$46  (via drill 0.61)
  Top 0.254: U4.19 108.94,19.41 v109.22,19.68
  Bottom 0.254: v109.22,19.68 109.64,20.11 R24.1
N$47
  Bottom 0.254: J10.2 147.64,33.34 147.64,35.24 146.69,36.2 R25.1
N$48
  Top 0.254: R11.1 139.91,31.54 140.34,31.11 D4.A 138.43,30.21 C7.1
N$49  (via drill 0.61)  (2 unrouted)
  Top 0.254: SW5.1 170.71,11.33 169.22,9.84 R30.2 158.43,9.84 153.67,5.08 149.86,5.08 v149.22,4.45 | SW2.1 132.81,24.04 133.99,22.86 133.99,14.61 139.06,9.53 v149.22,9.53
  Bottom 0.254: v149.22,9.53 v149.22,4.45
N$50  (2 unrouted)
  Bottom 0.254: SW6.2 172.72,25.69 172.72,32.06 SW3.1 | R29.2 157.48,32.38 159.17,34.07 SW3.2
N$51  (2 unrouted)
  Top 0.254: SW4.2 SW7.1 | SW7.2 154.05,19.68 R28.2
PGC  (via drill 0.61)
  Top 0.254: R8.1 151.76,22.86 151.13,22.23 v148.59,22.23
  Bottom 0.254: U3.27 147.96,19.68 148.59,20.32 v148.59,22.23
PGD  (via drill 0.61)
  Top 0.254: v142.88,22.23 R9.1
  Bottom 0.254: U3.28 143.51,20.95 142.88,21.59 v142.88,22.23
PGM  (via drill 0.61)
  Top 0.254: R10.2 v149.86,23.5 R7.1
  Bottom 0.254: U3.26 147.96,18.41 149.86,20.32 v149.86,23.5
REC_A  (via drill 0.61)
  Top 0.254: v160.02,6.99 160.02,5.08 156.21,1.27 23.5,1.27 21.84,2.92 D1.A
  Bottom 0.254: v160.02,6.99 160.02,15.24 158.12,17.14 U3.4
REC_K  (via drill 0.61)
  Top 0.254: R14.2 28.89,2.86 29.84,1.91 155.57,1.91 158.75,5.08 v158.75,7.62
  Bottom 0.254: v158.75,7.62 158.75,14.61 157.48,15.88 U3.5
RXD  (via drill 0.61)
  Top 0.254: v142.24,6.35 141.6,6.35 140.97,6.99 135.25,6.99 133.99,5.71 104.14,5.71 103.09,6.76 U4.1
  Bottom 0.254: U3.18 144.15,8.26 v142.24,6.35 TP12.1
SCL  (via drill 0.61)
  Top 0.254: O1.2 50.72,11.98 52.07,13.34 v78.74,13.34 | U1.6 v92.71,18.41 93.98,18.41 95.25,17.14 95.25,13.34 | v92.71,27.94 U2.6 | R6.2 95.25,13.34 | 95.25,13.34 95.25,11.43 102.23,4.45 135.25,4.45 136.53,5.71 139.7,5.71 142.24,3.17 151.76,3.17 v152.4,3.81
  Bottom 0.254: v78.74,13.34 87.63,13.34 v92.71,18.41 v92.71,27.94 | v152.4,3.81 153.03,4.45 U3.14 | TP7.1 51.44,12.06 50.72,11.35 O1.2
SDA  (via drill 0.61)
  Top 0.254: O1.3 48.72,12.53 50.8,14.61 v77.47,14.61 | U1.7 v88.27,19.68 93.98,19.68 | v88.27,28.57 88.9,29.21 U2.7 | 93.98,19.68 95.25,19.68 96.52,18.41 96.52,11.43 102.87,5.08 134.62,5.08 135.89,6.35 140.34,6.35 142.24,4.45 v143.51,4.45 | R5.2 93.98,19.68
  Bottom 0.254: v77.47,14.61 87,14.61 88.27,15.88 v88.27,19.68 v88.27,28.57 | v143.51,4.45 U3.15 | TP8.1 48.26,12.06 48.72,11.61 O1.3
TXD  (via drill 0.61)
  Top 0.254: v143.51,5.71 143.51,6.99 142.88,7.62 134.62,7.62 133.35,6.35 106.68,6.35 105.69,7.34 U4.5
  Bottom 0.254: U3.17 144.78,6.99 v143.51,5.71 142.24,4.45 TP13.1
USB_D+
  Top 0.254: J1.1 109.22,28.57 111.54,26.25 U4.15
  Bottom 0.254: C17.1 J1.1
USB_D-
  Top 0.254: J1.2 107.95,31.11 107.95,28.57 110.89,25.64 U4.16
  Bottom 0.254: J1.2 C16.1
USB_VCC  (via drill 0.61)
  Top 0.305: U4.20 108.29,19.34 v106.68,20.95
  Top 0.61: U5.2 99.06,24.13 100.02,25.09 C4.1 | U5.2 96.52,22.86 95.89,23.5 TP11.1 | F2.1 106.68,22.23 v106.68,20.95 104.14,20.95 102.23,22.86 U5.2
  Bottom 0.61: C14.2 v106.68,20.95
VPP  (via drill 0.61)
  Top 0.254: v149.22,36.2 148.59,36.83 142.88,36.83 141.6,35.56 141.6,28.57 141.24,28.21 D4.K 140.34,22.23 141.6,20.95 R12.1
  Bottom 0.254: J10.1 149.54,33.34 149.54,35.88 v149.22,36.2

### Text on the board
bPlace: ICSP
tNames: UP | MENU | USB_V | POWER | LEFT | OK | RIGHT | NHD-C0220BiZ-FSRGB | DOWN | 3.3v | REC | MSG | RESET
bNames: RED | GRN | RED | PGD | PGM | PGC | BLU | GRN | MCLR | BLU | RX | SDA | SCL | TX | RX | TX
_tsilk: SW3 | R11 | C9 | J1 | SW1 | UP | U2 | MENU | SW2 | SW7 | SW4 | SW6 | C7 | D4 | R9 | USB_V | C4 | C3 | R10 | R7 | R8 | POWER | C10 | R5 | U5 | F2 | C6 | LEFT | OK | RIGHT | NHD-C0220BiZ-FSRGB | R26 | R27 | R35 | D3 | R12 | SW5 | R28 | F1 | R34 | R16 | C5 | R15 | U1 | R6 | R19 | U4 | R30 | DOWN | 3.3v | R18 | R4 | O1 | SW8 | D1 | R14 | C1 | D2 | R13 | PVR | C2 | PC-01 | Rev. | B | R36 | REC | MSG | RESET
_bsilk: R25 | ICSP | C16 | J10 | R3 | RED | C17 | R33 | R29 | GRN | R21 | Q4 | RED | PGD | PGM | PGC | C14 | BLU | R24 | R1 | R31 | R23 | Q2 | GRN | MCLR | R2 | BLU | R32 | Q1 | Q3 | RX | SDA | SCL | R22 | C8 | TX | R17 | R20 | D5 | D6 | C13 | RX | C15 | TX | U3